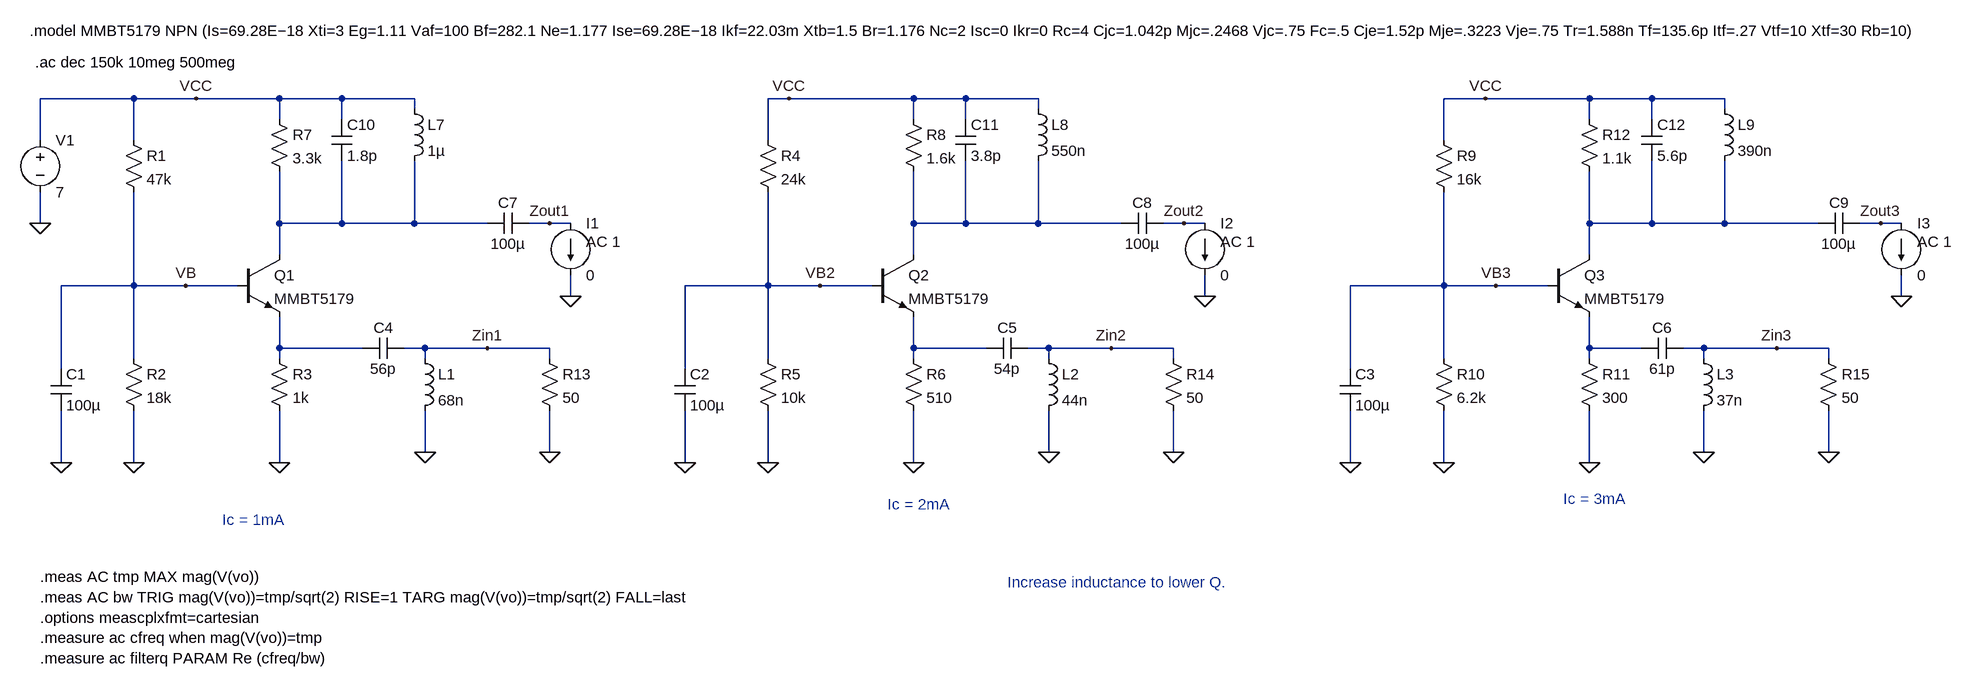
[diagram p0: schematic 6_Image_Filter.asc]
6_Image_Filter.asc, the LTspice schematic file:
Version 4
SHEET 1 1332 680
WIRE -2336 -2128 -2480 -2128
WIRE -2240 -2128 -2336 -2128
WIRE -2112 -2128 -2240 -2128
WIRE -2016 -2128 -2112 -2128
WIRE -1904 -2128 -2016 -2128
WIRE -1328 -2128 -1360 -2128
WIRE -1136 -2128 -1328 -2128
WIRE -1056 -2128 -1136 -2128
WIRE -944 -2128 -1056 -2128
WIRE -256 -2128 -320 -2128
WIRE -96 -2128 -256 -2128
WIRE 0 -2128 -96 -2128
WIRE 112 -2128 0 -2128
WIRE -1904 -2112 -1904 -2128
WIRE -944 -2112 -944 -2128
WIRE 112 -2112 112 -2128
WIRE -2112 -2096 -2112 -2128
WIRE -2016 -2096 -2016 -2128
WIRE -1136 -2096 -1136 -2128
WIRE -1056 -2096 -1056 -2128
WIRE -96 -2096 -96 -2128
WIRE 0 -2096 0 -2128
WIRE -2480 -2064 -2480 -2128
WIRE -2336 -2064 -2336 -2128
WIRE -1360 -2064 -1360 -2128
WIRE -320 -2064 -320 -2128
WIRE -2480 -1936 -2480 -1984
WIRE -2112 -1936 -2112 -2016
WIRE -2016 -1936 -2016 -2032
WIRE -2016 -1936 -2112 -1936
WIRE -1904 -1936 -1904 -2032
WIRE -1904 -1936 -2016 -1936
WIRE -1792 -1936 -1904 -1936
WIRE -1696 -1936 -1728 -1936
WIRE -1664 -1936 -1696 -1936
WIRE -1136 -1936 -1136 -2016
WIRE -1056 -1936 -1056 -2032
WIRE -1056 -1936 -1136 -1936
WIRE -944 -1936 -944 -2032
WIRE -944 -1936 -1056 -1936
WIRE -816 -1936 -944 -1936
WIRE -720 -1936 -752 -1936
WIRE -688 -1936 -720 -1936
WIRE -96 -1936 -96 -2016
WIRE 0 -1936 0 -2032
WIRE 0 -1936 -96 -1936
WIRE 112 -1936 112 -2032
WIRE 112 -1936 0 -1936
WIRE 256 -1936 112 -1936
WIRE 352 -1936 320 -1936
WIRE 384 -1936 352 -1936
WIRE -2112 -1888 -2112 -1936
WIRE -1136 -1888 -1136 -1936
WIRE -96 -1888 -96 -1936
WIRE -2336 -1840 -2336 -1984
WIRE -2336 -1840 -2448 -1840
WIRE -2256 -1840 -2336 -1840
WIRE -2176 -1840 -2256 -1840
WIRE -1360 -1840 -1360 -1984
WIRE -1360 -1840 -1488 -1840
WIRE -1280 -1840 -1360 -1840
WIRE -1200 -1840 -1280 -1840
WIRE -320 -1840 -320 -1984
WIRE -320 -1840 -464 -1840
WIRE -240 -1840 -320 -1840
WIRE -160 -1840 -240 -1840
WIRE -1664 -1824 -1664 -1856
WIRE -688 -1824 -688 -1856
WIRE 384 -1824 384 -1856
WIRE -2112 -1744 -2112 -1792
WIRE -1984 -1744 -2112 -1744
WIRE -1888 -1744 -1920 -1744
WIRE -1792 -1744 -1888 -1744
WIRE -1696 -1744 -1792 -1744
WIRE -1136 -1744 -1136 -1792
WIRE -1024 -1744 -1136 -1744
WIRE -928 -1744 -960 -1744
WIRE -832 -1744 -928 -1744
WIRE -736 -1744 -832 -1744
WIRE -96 -1744 -96 -1792
WIRE -16 -1744 -96 -1744
WIRE 80 -1744 48 -1744
WIRE 192 -1744 80 -1744
WIRE 272 -1744 192 -1744
WIRE -2336 -1728 -2336 -1840
WIRE -2112 -1728 -2112 -1744
WIRE -1888 -1728 -1888 -1744
WIRE -1696 -1728 -1696 -1744
WIRE -1360 -1728 -1360 -1840
WIRE -1136 -1728 -1136 -1744
WIRE -928 -1728 -928 -1744
WIRE -736 -1728 -736 -1744
WIRE -320 -1728 -320 -1840
WIRE -96 -1728 -96 -1744
WIRE 80 -1728 80 -1744
WIRE 272 -1728 272 -1744
WIRE -2448 -1712 -2448 -1840
WIRE -1488 -1712 -1488 -1840
WIRE -464 -1712 -464 -1840
WIRE -1888 -1584 -1888 -1648
WIRE -1696 -1584 -1696 -1648
WIRE -928 -1584 -928 -1648
WIRE -736 -1584 -736 -1648
WIRE 80 -1584 80 -1648
WIRE 272 -1584 272 -1648
WIRE -2448 -1568 -2448 -1648
WIRE -2336 -1568 -2336 -1648
WIRE -2112 -1568 -2112 -1648
WIRE -1488 -1568 -1488 -1648
WIRE -1360 -1568 -1360 -1648
WIRE -1136 -1568 -1136 -1648
WIRE -464 -1568 -464 -1648
WIRE -320 -1568 -320 -1648
WIRE -96 -1568 -96 -1648
FLAG -2480 -1936 0
FLAG -2336 -1568 0
FLAG -2112 -1568 0
FLAG -2256 -1840 VB
FLAG -2240 -2128 VCC
FLAG -2448 -1568 0
FLAG -1360 -1568 0
FLAG -1136 -1568 0
FLAG -1280 -1840 VB2
FLAG -1328 -2128 VCC
FLAG -1488 -1568 0
FLAG -320 -1568 0
FLAG -96 -1568 0
FLAG -240 -1840 VB3
FLAG -464 -1568 0
FLAG -256 -2128 VCC
FLAG -1696 -1584 0
FLAG -1888 -1584 0
FLAG -736 -1584 0
FLAG -928 -1584 0
FLAG 272 -1584 0
FLAG 80 -1584 0
FLAG -1792 -1744 Zin1
FLAG -832 -1744 Zin2
FLAG 192 -1744 Zin3
FLAG -1664 -1824 0
FLAG -688 -1824 0
FLAG 384 -1824 0
FLAG -1696 -1936 Zout1
FLAG -720 -1936 Zout2
FLAG 352 -1936 Zout3
SYMBOL res -2352 -2080 R0
SYMATTR InstName R1
SYMATTR Value 47k
SYMBOL res -2352 -1744 R0
SYMATTR InstName R2
SYMATTR Value 18k
SYMBOL res -2128 -1744 R0
SYMATTR InstName R3
SYMATTR Value 1k
SYMBOL voltage -2480 -2080 R0
WINDOW 123 0 0 Left 0
WINDOW 39 0 0 Left 0
SYMATTR InstName V1
SYMATTR Value 7
SYMBOL npn -2176 -1888 R0
SYMATTR InstName Q1
SYMATTR Value MMBT5179
SYMBOL cap -2464 -1712 R0
SYMATTR InstName C1
SYMATTR Value 100µ
SYMBOL res -1376 -2080 R0
SYMATTR InstName R4
SYMATTR Value 24k
SYMBOL res -1376 -1744 R0
SYMATTR InstName R5
SYMATTR Value 10k
SYMBOL res -1152 -1744 R0
SYMATTR InstName R6
SYMATTR Value 510
SYMBOL npn -1200 -1888 R0
SYMATTR InstName Q2
SYMATTR Value MMBT5179
SYMBOL cap -1504 -1712 R0
SYMATTR InstName C2
SYMATTR Value 100µ
SYMBOL res -336 -2080 R0
SYMATTR InstName R9
SYMATTR Value 16k
SYMBOL res -336 -1744 R0
SYMATTR InstName R10
SYMATTR Value 6.2k
SYMBOL res -112 -1744 R0
SYMATTR InstName R11
SYMATTR Value 300
SYMBOL npn -160 -1888 R0
SYMATTR InstName Q3
SYMATTR Value MMBT5179
SYMBOL cap -480 -1712 R0
SYMATTR InstName C3
SYMATTR Value 100µ
SYMBOL cap -1920 -1760 R90
WINDOW 0 0 32 VBottom 2
WINDOW 3 32 32 VTop 2
SYMATTR InstName C4
SYMATTR Value 56p
SYMBOL ind -1904 -1744 R0
SYMATTR InstName L1
SYMATTR Value 68n
SYMBOL cap -960 -1760 R90
WINDOW 0 0 32 VBottom 2
WINDOW 3 32 32 VTop 2
SYMATTR InstName C5
SYMATTR Value 54p
SYMBOL ind -944 -1744 R0
SYMATTR InstName L2
SYMATTR Value 44n
SYMBOL cap 48 -1760 R90
WINDOW 0 0 32 VBottom 2
WINDOW 3 32 32 VTop 2
SYMATTR InstName C6
SYMATTR Value 61p
SYMBOL ind 64 -1744 R0
SYMATTR InstName L3
SYMATTR Value 37n
SYMBOL ind -1920 -2128 R0
SYMATTR InstName L7
SYMATTR Value 1µ
SYMBOL cap -2032 -2096 R0
SYMATTR InstName C10
SYMATTR Value 1.8p
SYMBOL ind -960 -2128 R0
SYMATTR InstName L8
SYMATTR Value 550n
SYMBOL cap -1072 -2096 R0
SYMATTR InstName C11
SYMATTR Value 3.8p
SYMBOL ind 96 -2128 R0
SYMATTR InstName L9
SYMATTR Value 390n
SYMBOL cap -16 -2096 R0
SYMATTR InstName C12
SYMATTR Value 5.6p
SYMBOL current -1664 -1936 R0
WINDOW 123 24 28 Left 2
WINDOW 39 0 0 Left 0
SYMATTR Value2 AC 1
SYMATTR InstName I1
SYMATTR Value 0
SYMBOL cap -1728 -1952 R90
WINDOW 0 0 32 VBottom 2
WINDOW 3 32 32 VTop 2
SYMATTR InstName C7
SYMATTR Value 100µ
SYMBOL current -688 -1936 R0
WINDOW 123 24 28 Left 2
WINDOW 39 0 0 Left 0
SYMATTR Value2 AC 1
SYMATTR InstName I2
SYMATTR Value 0
SYMBOL cap -752 -1952 R90
WINDOW 0 0 32 VBottom 2
WINDOW 3 32 32 VTop 2
SYMATTR InstName C8
SYMATTR Value 100µ
SYMBOL current 384 -1936 R0
WINDOW 123 24 28 Left 2
WINDOW 39 0 0 Left 0
SYMATTR Value2 AC 1
SYMATTR InstName I3
SYMATTR Value 0
SYMBOL cap 320 -1952 R90
WINDOW 0 0 32 VBottom 2
WINDOW 3 32 32 VTop 2
SYMATTR InstName C9
SYMATTR Value 100µ
SYMBOL res -2128 -2112 R0
SYMATTR InstName R7
SYMATTR Value 3.3k
SYMBOL res -1152 -2112 R0
SYMATTR InstName R8
SYMATTR Value 1.6k
SYMBOL res -112 -2112 R0
SYMATTR InstName R12
SYMATTR Value 1.1k
SYMBOL res -1712 -1744 R0
SYMATTR InstName R13
SYMATTR Value 50
SYMBOL res -752 -1744 R0
SYMATTR InstName R14
SYMATTR Value 50
SYMBOL res 256 -1744 R0
SYMATTR InstName R15
SYMATTR Value 50
TEXT -2496 -2232 Left 2 !.model MMBT5179 NPN (Is=69.28E−18 Xti=3 Eg=1.11 Vaf=100 Bf=282.1 Ne=1.177 Ise=69.28E−18 Ikf=22.03m Xtb=1.5 Br=1.176 Nc=2 Isc=0 Ikr=0 Rc=4 Cjc=1.042p Mjc=.2468 Vjc=.75 Fc=.5 Cje=1.52p Mje=.3223 Vje=.75 Tr=1.588n Tf=135.6p Itf=.27 Vtf=10 Xtf=30 Rb=10)
TEXT -2488 -2184 Left 2 !.ac dec 150k 10meg 500meg
TEXT -2200 -1480 Left 2 ;Ic = 1mA
TEXT -1176 -1504 Left 2 ;Ic = 2mA
TEXT -136 -1512 Left 2 ;Ic = 3mA
TEXT -2480 -1392 Left 2 !.meas AC tmp MAX mag(V(vo))\n.meas AC bw TRIG mag(V(vo))=tmp/sqrt(2) RISE=1 TARG mag(V(vo))=tmp/sqrt(2) FALL=last\n.options meascplxfmt=cartesian\n.measure ac cfreq when mag(V(vo))=tmp\n.measure ac filterq PARAM Re (cfreq/bw)
TEXT -992 -1384 Left 2 ;Increase inductance to lower Q.

The netlist it stands for:
* 6_Image_Filter.asc
R1 VCC VB 47k
R2 VB 0 18k
R3 N004 0 1k
V1 VCC 0 7
Q1 N001 VB N004 0 MMBT5179
C1 VB 0 100µ
R4 VCC VB2 24k
R5 VB2 0 10k
R6 N005 0 510
Q2 N002 VB2 N005 0 MMBT5179
C2 VB2 0 100µ
R9 VCC VB3 16k
R10 VB3 0 6.2k
R11 N006 0 300
Q3 N003 VB3 N006 0 MMBT5179
C3 VB3 0 100µ
C4 Zin1 N004 56p
L1 Zin1 0 68n
C5 Zin2 N005 54p
L2 Zin2 0 44n
C6 Zin3 N006 61p
L3 Zin3 0 37n
L7 VCC N001 1µ
C10 VCC N001 1.8p
L8 VCC N002 550n
C11 VCC N002 3.8p
L9 VCC N003 390n
C12 VCC N003 5.6p
I1 Zout1 0 0 AC 1
C7 Zout1 N001 100µ
I2 Zout2 0 0 AC 1
C8 Zout2 N002 100µ
I3 Zout3 0 0 AC 1
C9 Zout3 N003 100µ
R7 VCC N001 3.3k
R8 VCC N002 1.6k
R12 VCC N003 1.1k
R13 Zin1 0 50
R14 Zin2 0 50
R15 Zin3 0 50
.model NPN NPN
.model PNP PNP
.lib standard.bjt
.model MMBT5179 NPN (Is=69.28E−18 Xti=3 Eg=1.11 Vaf=100 Bf=282.1 Ne=1.177 Ise=69.28E−18 Ikf=22.03m Xtb=1.5 Br=1.176 Nc=2 Isc=0 Ikr=0 Rc=4 Cjc=1.042p Mjc=.2468 Vjc=.75 Fc=.5 Cje=1.52p Mje=.3223 Vje=.75 Tr=1.588n Tf=135.6p Itf=.27 Vtf=10 Xtf=30 Rb=10)
.ac dec 150k 10meg 500meg
* Ic = 1mA
* Ic = 2mA
* Ic = 3mA
.meas AC tmp MAX mag(V(vo))
.meas AC bw TRIG mag(V(vo))=tmp/sqrt(2) RISE=1 TARG mag(V(vo))=tmp/sqrt(2) FALL=last
.options meascplxfmt=cartesian
.measure ac cfreq when mag(V(vo))=tmp
.measure ac filterq PARAM Re (cfreq/bw)
* Increase inductance to lower Q.
.backanno
.end